# EAGLE design gk+midi board v2.5 (EAGLE 6.3)

## Sheet 1 of 4
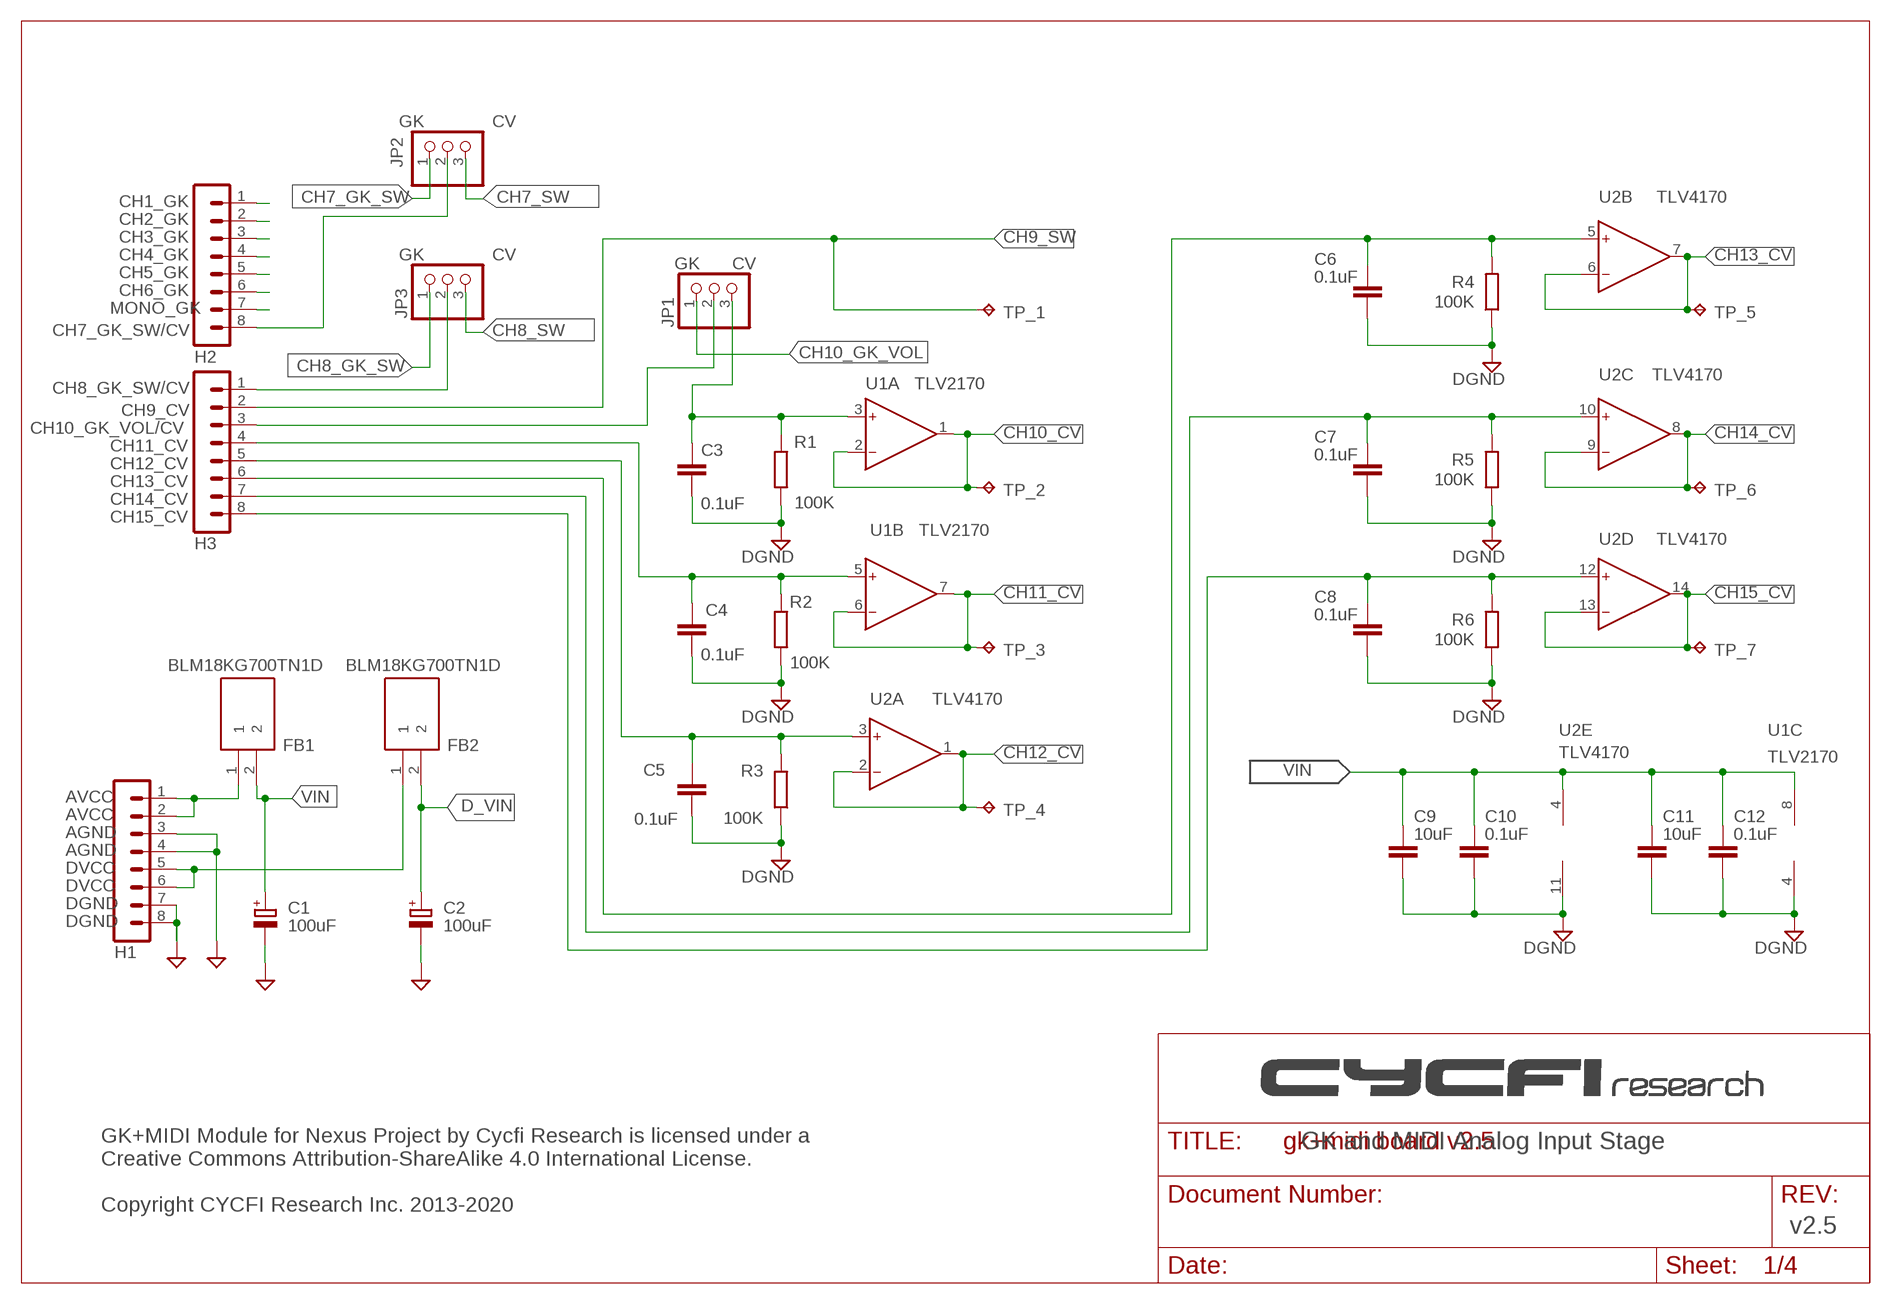
[diagram p0: schematic, sheet 1]

### Parts
C1  100uF  CPOL-EU153CLV-0505  [153CLV-0505]
C2  100uF  CPOL-EU153CLV-0505  [153CLV-0505]
C3  0.1uF  C-EUC0603  [C0603]
C4  0.1uF  C-EUC0603  [C0603]
C5  0.1uF  C-EUC0603  [C0603]
C6  0.1uF  C-EUC0603  [C0603]
C7  0.1uF  C-EUC0603  [C0603]
C8  0.1uF  C-EUC0603  [C0603]
C9  10uF  C-EUC0805  [C0805]
C10  0.1uF  C-EUC0603  [C0603]
C11  10uF  C-EUC0805  [C0805]
C12  0.1uF  C-EUC0603  [C0603]
FB1  BLM18KG700TN1D  [BEADC1608X75N]
FB2  BLM18KG700TN1D  [BEADC1608X75N]
H1  MA08-1  [MA08-1]
H2  MA08-1  [MA08-1]
H3  MA08-1  [MA08-1]
JP1  PINHD-1X03_2.00  [1X03M]
JP2  PINHD-1X03_2.00  [1X03M]
JP3  PINHD-1X03_2.00  [1X03M]
R1  100K  R-EU_R0402  [R0402]
R2  100K  R-EU_R0402  [R0402]
R3  100K  R-EU_R0402  [R0402]
R4  100K  R-EU_R0402  [R0402]
R5  100K  R-EU_R0402  [R0402]
R6  100K  R-EU_R0402  [R0402]
TP_1  TPB1,27  [B1,27]
TP_2  TPB1,27  [B1,27]
TP_3  TPB1,27  [B1,27]
TP_4  TPB1,27  [B1,27]
TP_5  TPB1,27  [B1,27]
TP_6  TPB1,27  [B1,27]
TP_7  TPB1,27  [B1,27]
U1  TLV2170DGKT  [MSOP8]
U2  LMV324  [SSOP-14]

### Nets
AVCC: FB1.1 H1.1 H1.2
CH1_GK: H2.1 ; also sheet 2
CH2_GK: H2.2 ; also sheet 2
CH3_GK: H2.3 ; also sheet 2
CH4_GK: H2.4 ; also sheet 2
CH5_GK: H2.5 ; also sheet 2
CH6_GK: H2.6 ; also sheet 2
CH7_GK_SW: JP2.1 ; also sheet 2
CH7_GK_SW/CV: H2.8 JP2.2
CH7_SW: JP2.3 ; also sheet 3,4
CH8_GK_SW: JP3.1 ; also sheet 2
CH8_GK_SW/CV: H3.1 JP3.2
CH8_SW: JP3.3 ; also sheet 3,4
CH9_SW: H3.2 TP_1.TP ; also sheet 3,4
CH10_CV: TP_2.TP U1.1(OUT) U1.2(IN-) ; also sheet 3
CH10_GK_VOL: JP1.1 ; also sheet 2
CH11_CV: TP_3.TP U1.6(IN-) U1.7(OUT) ; also sheet 3
CH12_CV: TP_4.TP U2.1(OUT) U2.2(IN-) ; also sheet 3
CH13_CV: TP_5.TP U2.6(IN-) U2.7(OUT) ; also sheet 3
CH14_CV: TP_6.TP U2.8(OUT) U2.9(IN-) ; also sheet 3
CH15_CV: TP_7.TP U2.13(IN-) U2.14(OUT) ; also sheet 3
CH15_CV_IN: C8.1 H3.8 R6.2 U2.12(IN+)
D_VIN: C2.+ FB2.2 ; also sheet 4
DVCC: FB2.1 H1.5 H1.6
GND: C1.- C2.- C3.2 C4.2 C5.2 C6.2 C7.2 C8.2 C9.2 C10.2 C11.2 C12.2 H1.3 H1.4 H1.7 H1.8 R1.1 R2.1 R3.1 R4.1 R5.1 R6.1 U1.4(V-) U2.11(P1:V-) ; supply symbol labelled DGND ; also sheet 2,3,4
MONO_GK: H2.7 ; also sheet 2
N$4: H3.3 JP1.2
N$10: C3.1 JP1.3 R1.2 U1.3(IN+)
N$11: C4.1 H3.4 R2.2 U1.5(IN+)
N$14: C5.1 H3.5 R3.2 U2.3(IN+)
N$19: C6.1 H3.6 R4.2 U2.5(IN+)
N$20: C7.1 H3.7 R5.2 U2.10(IN+)
VIN: C1.+ C9.1 C10.1 C11.1 C12.1 FB1.2 U1.8(V+) U2.4(P1:V+)

### Notes on the sheet
- GK | CV
- CH1_GK | U2B | TLV4170
- CH2_GK
- CH3_GK
- CH4_GK | GK | CV
- GK | CV
- CH5_GK
- CH6_GK
- MONO_GK
- CH7_GK_SW/CV
- U2C | TLV4170
- CH8_GK_SW/CV | U1A | TLV2170
- CH9_CV
- CH10_GK_VOL/CV
- CH11_CV
- CH12_CV
- CH13_CV
- CH14_CV
- CH15_CV
- U1B | TLV2170
- U2D | TLV4170
- U2A | TLV4170
- U2E | U1C
- TLV4170 | TLV2170
- AGND
- AGND
- DGND
- DGND
- GK and MIDI Analog Input Stage
- GK+MIDI Module for Nexus Project by Cycfi Research is licensed under a 
  Creative Commons Attribution-ShareAlike 4.0 International License.
  
  Copyright CYCFI Research Inc. 2013-2020
- v2.5

## Sheet 2 of 4
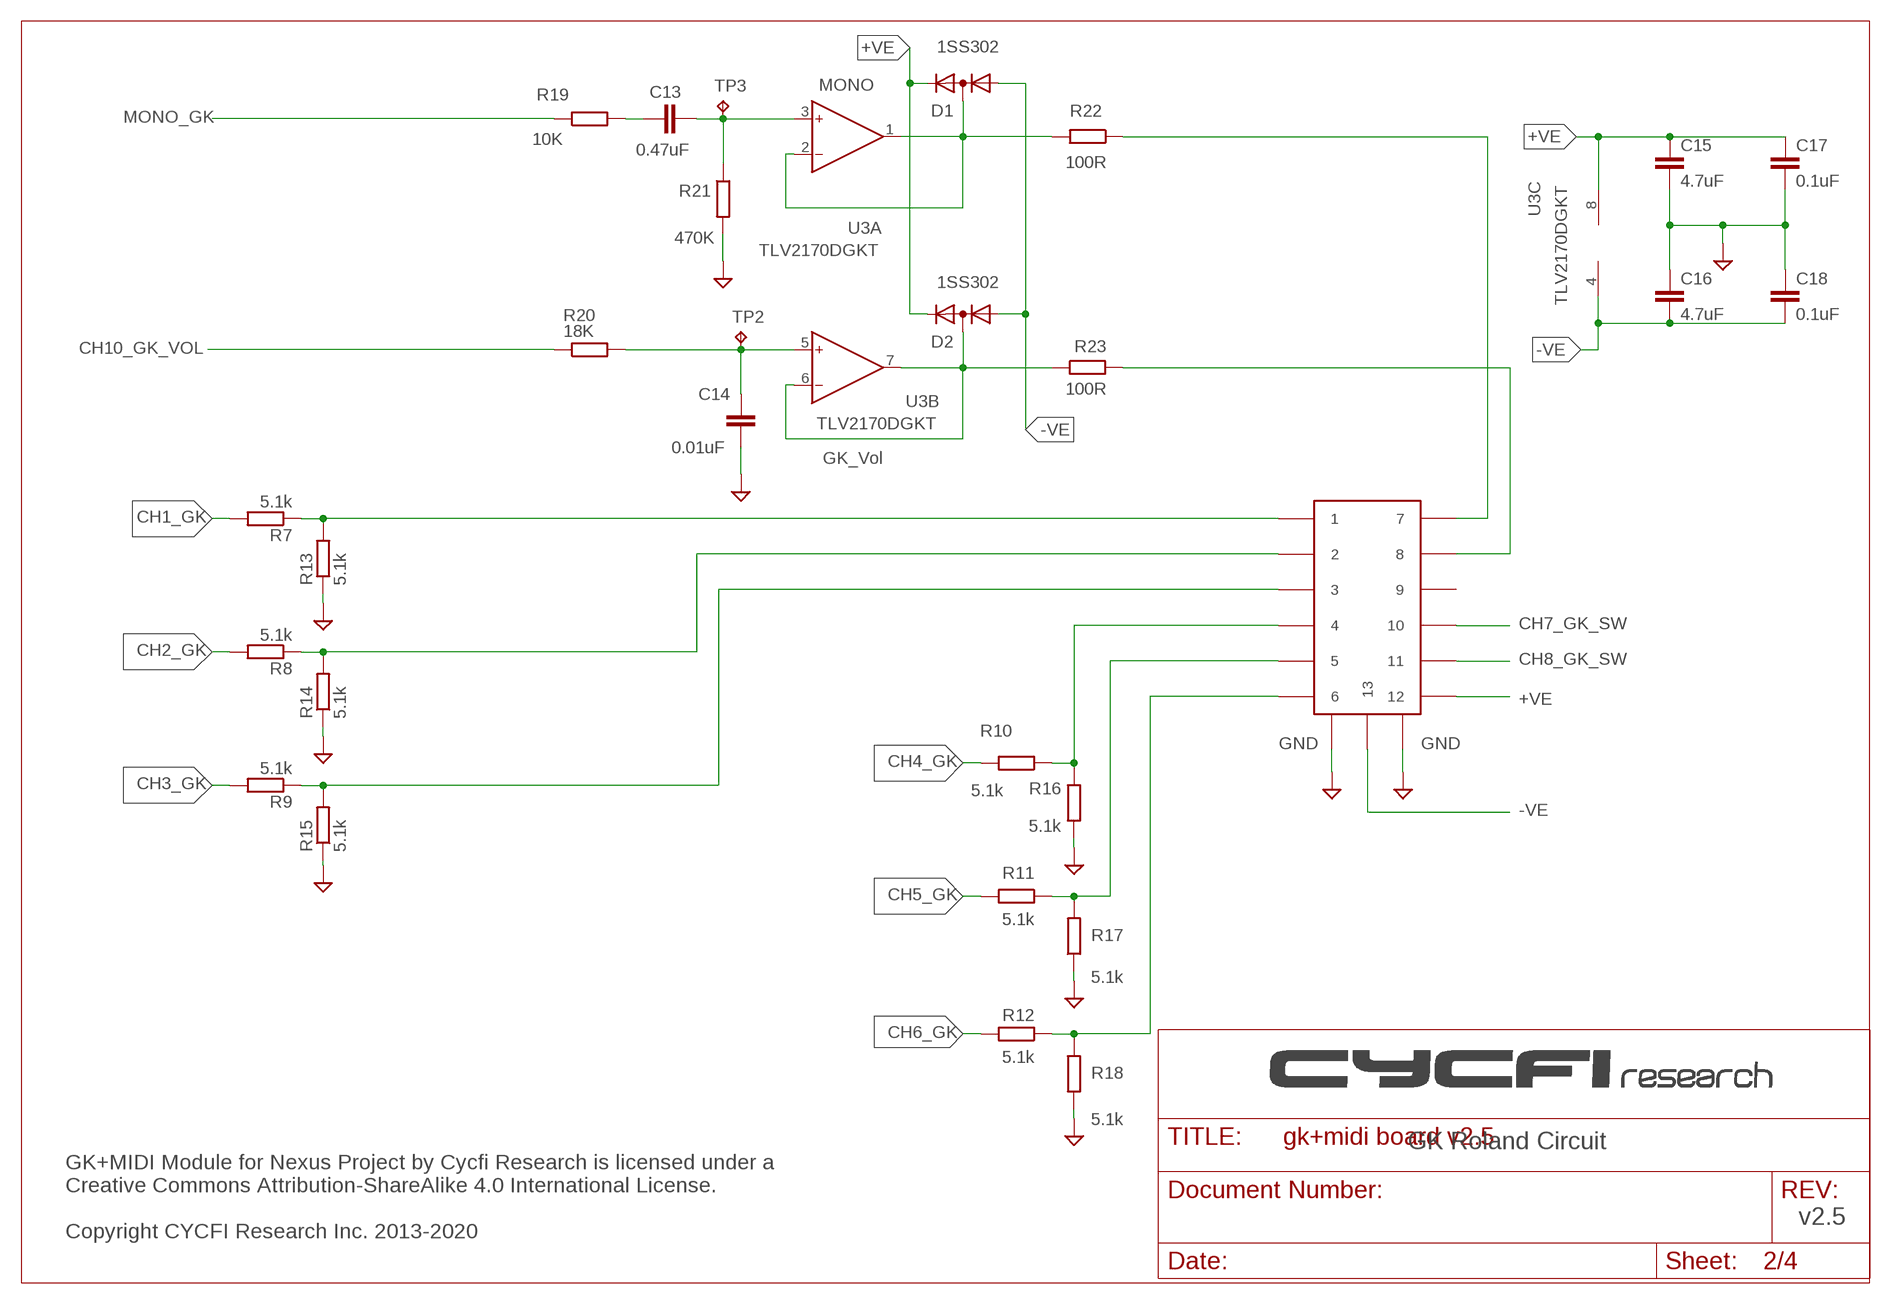
[diagram p1: schematic, sheet 2]

### Parts
C13  0.47uF  C-EUC0603  [C0603]
C14  0.01uF  C-EUC0402  [C0402]
C15  4.7uF  C-EUC0603  [C0603]
C16  4.7uF  C-EUC0603  [C0603]
C17  0.1uF  C-EUC0402  [C0402]
C18  0.1uF  C-EUC0402  [C0402]
D1  1SS302  [SC70-3]
D2  1SS302  [SC70-3]
R7  5.1k  R-EU_R0402  [R0402]
R8  5.1k  R-EU_R0402  [R0402]
R9  5.1k  R-EU_R0402  [R0402]
R10  5.1k  R-EU_R0402  [R0402]
R11  5.1k  R-EU_R0402  [R0402]
R12  5.1k  R-EU_R0402  [R0402]
R13  5.1k  R-EU_R0402  [R0402]
R14  5.1k  R-EU_R0402  [R0402]
R15  5.1k  R-EU_R0402  [R0402]
R16  5.1k  R-EU_R0402  [R0402]
R17  5.1k  R-EU_R0402  [R0402]
R18  5.1k  R-EU_R0402  [R0402]
R19  10K  R-EU_R0402  [R0402]
R20  18K  R-EU_R0402  [R0402]
R21  470K  R-EU_R0402  [R0402]
R22  100R  R-EU_R0402  [R0402]
R23  100R  R-EU_R0402  [R0402]
TP2  TPB1,27  [B1,27]
TP3  TPB1,27  [B1,27]
U3  TLV2170DGKT  [MSOP8]
U$1  13P_MIDI_2  [13P-MIDI-2]

### Nets
+VE: C15.1 C17.1 D1.2(K) D2.2(K) U3.8(V+) U$1.12
-VE: C16.2 C18.2 D1.1(A) D2.1(A) U3.4(V-) U$1.13
CH1_GK: R7.2 ; also sheet 1
CH2_GK: R8.2 ; also sheet 1
CH3_GK: R9.2 ; also sheet 1
CH4_GK: R10.2 ; also sheet 1
CH5_GK: R11.2 ; also sheet 1
CH6_GK: R12.2 ; also sheet 1
CH7_GK_SW: U$1.10 ; also sheet 1
CH8_GK_SW: U$1.11 ; also sheet 1
CH10_GK_VOL: R20.1 ; also sheet 1
GK_VOL: R23.2 U$1.8
GND: C14.2 C15.2 C16.1 C17.2 C18.1 R13.1 R14.1 R15.1 R16.1 R17.1 R18.1 R21.2 U$1.P$1 U$1.P$2 ; also sheet 1,3,4
MONO_GK: R19.1 ; also sheet 1
N$21: R22.1 U$1.7
N$35: D2.3(AK) R23.1 U3.6(IN-) U3.7(OUT)
N$36: C14.1 R20.2 TP2.TP U3.5(IN+)
N$37: C13.2 R19.2
N$38: C13.1 R21.1 TP3.TP U3.3(IN+)
N$39: D1.3(AK) R22.2 U3.1(OUT) U3.2(IN-)
N$42: R7.1 R13.2 U$1.1
N$43: R8.1 R14.2 U$1.2
N$44: R9.1 R15.2 U$1.3
N$45: R10.1 R16.2 U$1.4
N$46: R11.1 R17.2 U$1.5
N$47: R12.1 R18.2 U$1.6
Unconnected: U$1.9

### Notes on the sheet
- MONO
- U3C
- U3A
- U3B
- GK_Vol
- GK Roland Circuit
- v2.5
- GK+MIDI Module for Nexus Project by Cycfi Research is licensed under a 
  Creative Commons Attribution-ShareAlike 4.0 International License.
  
  Copyright CYCFI Research Inc. 2013-2020

## Sheet 3 of 4
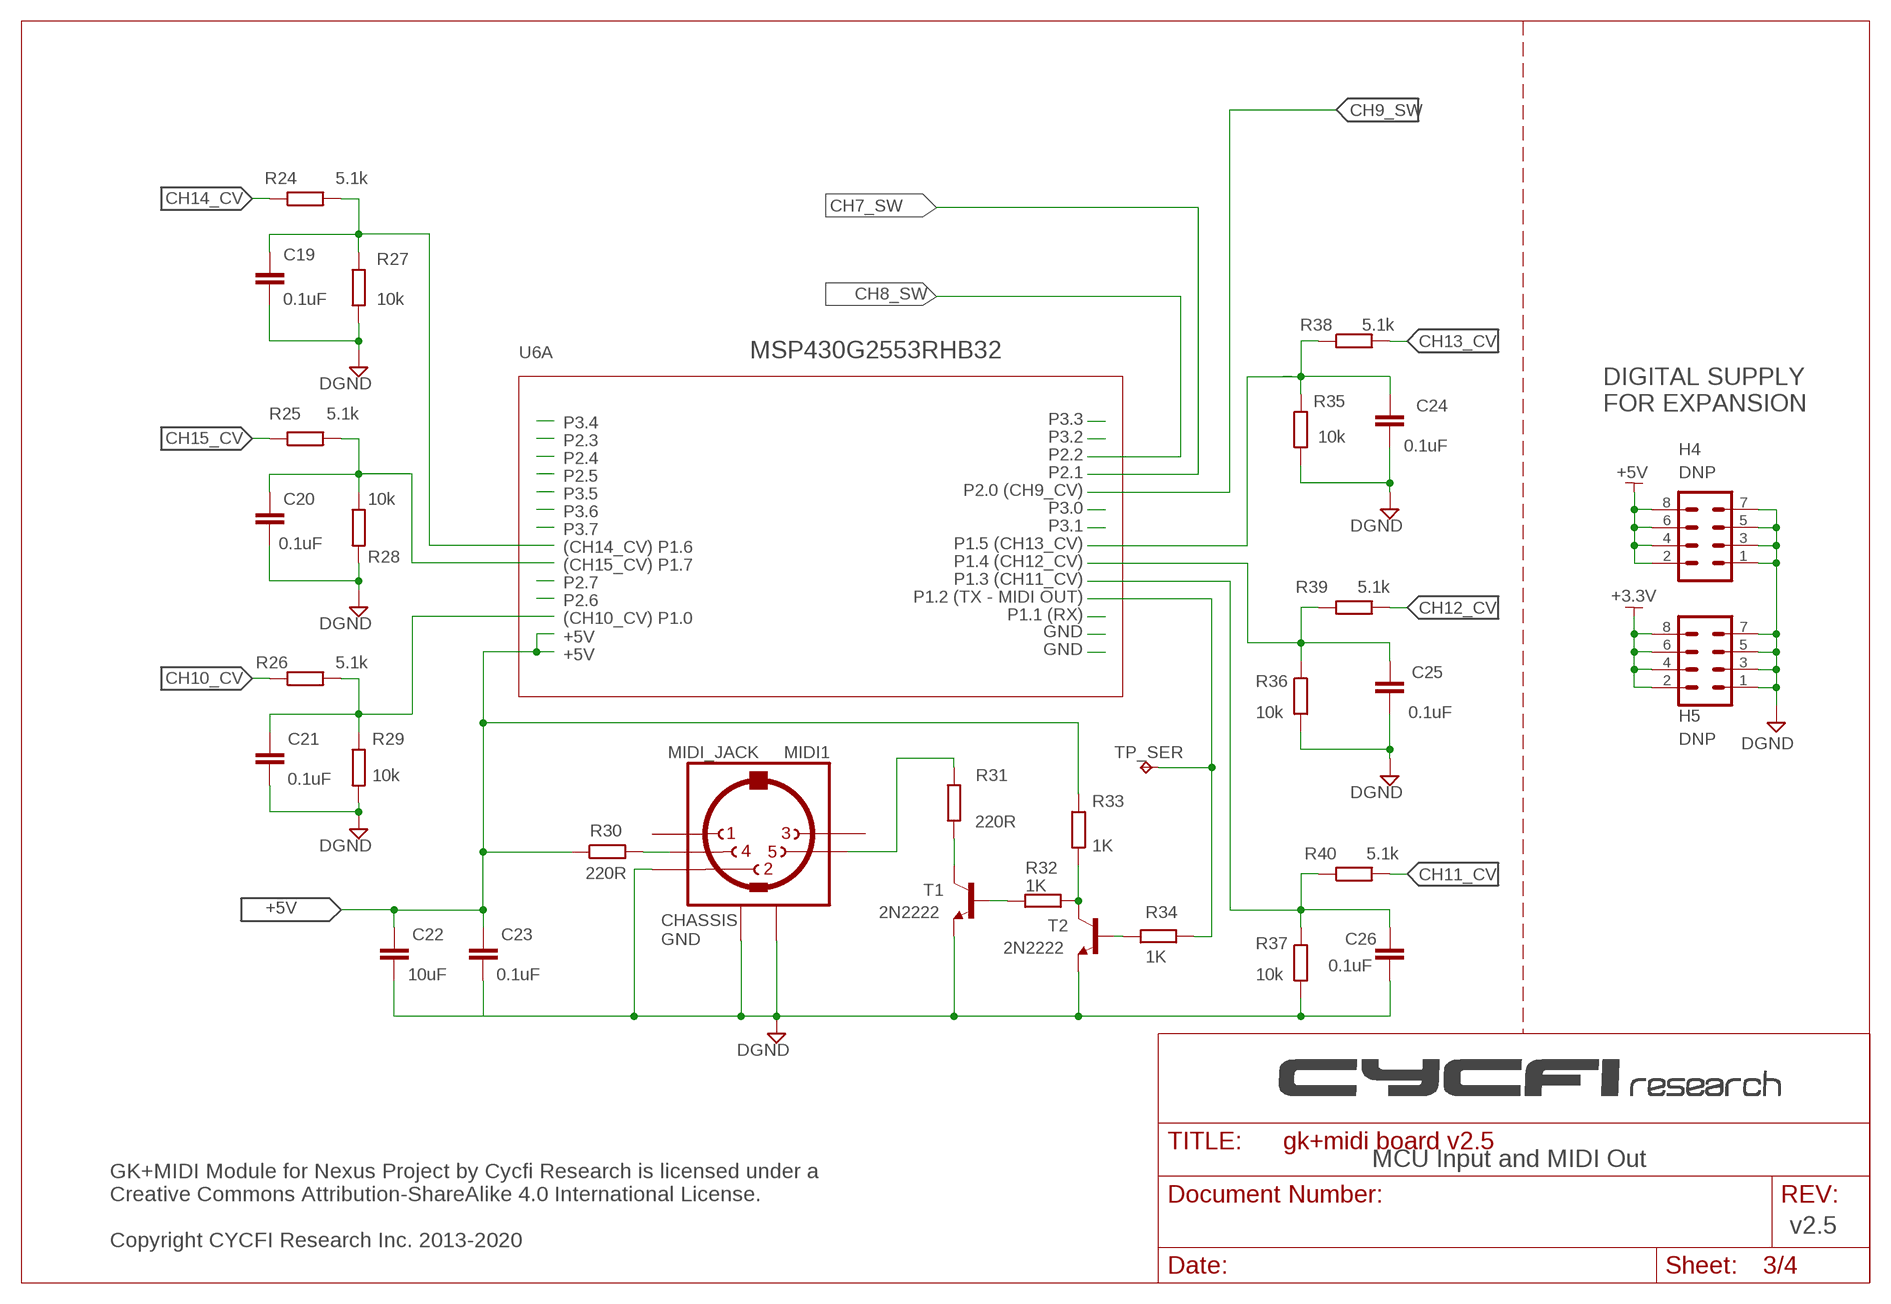
[diagram p2: schematic, sheet 3]

### Parts
C19  0.1uF  C-EUC0603  [C0603]
C20  0.1uF  C-EUC0603  [C0603]
C21  0.1uF  C-EUC0603  [C0603]
C22  10uF  C-EUC0805  [C0805]
C23  0.1uF  C-EUC0603  [C0603]
C24  0.1uF  C-EUC0603  [C0603]
C25  0.1uF  C-EUC0603  [C0603]
C26  0.1uF  C-EUC0603  [C0603]
H4  DNP  MA04-2  [MA04-2]
H5  DNP  MA04-2  [MA04-2]
MIDI1  MIDI_JACK  [MIDI_JACK]
R24  5.1k  R-EU_R0402  [R0402]
R25  5.1k  R-EU_R0402  [R0402]
R26  5.1k  R-EU_R0402  [R0402]
R27  10k  R-EU_R0402  [R0402]
R28  10k  R-EU_R0402  [R0402]
R29  10k  R-EU_R0402  [R0402]
R30  220R  R-EU_R0603  [R0603]
R31  220R  R-EU_R0603  [R0603]
R32  1K  R-EU_R0402  [R0402]
R33  1K  R-EU_R0402  [R0402]
R34  1K  R-EU_R0402  [R0402]
R35  10k  R-EU_R0402  [R0402]
R36  10k  R-EU_R0402  [R0402]
R37  10k  R-EU_R0402  [R0402]
R38  5.1k  R-EU_R0402  [R0402]
R39  5.1k  R-EU_R0402  [R0402]
R40  5.1k  R-EU_R0402  [R0402]
T1  2N2222  TRAN-MMBT2222A  [SOT23-3]
T2  2N2222  TRAN-MMBT2222A  [SOT23-3]
TP_SER  TPB1,27  [B1,27]

### Nets
+3.3V: H5.2 H5.4 H5.6 H5.8 ; also sheet 4
+5V: C22.1 C23.1 H4.2 H4.4 H4.6 H4.8 R30.1 R33.2 ; also sheet 4
CH10_CV: R26.1 ; also sheet 1
CH11_CV: R40.2 ; also sheet 1
CH12_CV: R39.2 ; also sheet 1
CH13_CV: R38.2 ; also sheet 1
CH14_CV: R24.1 ; also sheet 1
CH15_CV: R25.1 ; also sheet 1
GND: C19.2 C20.2 C21.2 C22.2 C23.2 C24.2 C25.2 C26.2 H4.1 H4.3 H4.5 H4.7 H5.1 H5.3 H5.5 H5.7 MIDI1.2 MIDI1.G1 MIDI1.G2 R27.2 R28.2 R29.2 R35.2 R36.2 R37.2 T1.2(E) T2.2(E) ; supply symbol labelled DGND ; also sheet 1,2,4
N$1: MIDI1.5 R31.2
N$2: R31.1 T1.3(C)
N$3: R32.2 T1.1(B)
N$5: MIDI1.4 R30.2
N$8: R34.2 T2.1(B)
N$9: R32.1 R33.1 T2.3(C)
P1.0: C21.1 R26.2 R29.1 ; also sheet 4
P1.2: R34.1 TP_SER.TP ; also sheet 4
P1.3: C26.1 R37.1 R40.1 ; also sheet 4
P1.4: C25.1 R36.1 R39.1 ; also sheet 4
P1.5: C24.1 R35.1 R38.1 ; also sheet 4
P1.6: C19.1 R24.2 R27.1 ; also sheet 4
P1.7: C20.1 R25.2 R28.1 ; also sheet 4
Unconnected: MIDI1.1 MIDI1.3

### Notes on the sheet
- U6A | MSP430G2553RHB32
- DIGITAL SUPPLY
  FOR EXPANSION
- P3.4
- P3.3
- P2.3
- P3.2
- P2.4
- P2.2
- P2.5
- P2.1
- P3.5
- P2.0 (CH9_CV)
- P3.6
- P3.0
- P3.7
- P3.1
- (CH14_CV) P1.6
- P1.5 (CH13_CV)
- (CH15_CV) P1.7
- P1.4 (CH12_CV)
- P2.7
- P1.3 (CH11_CV)
- P2.6
- P1.2 (TX - MIDI OUT)
- (CH10_CV) P1.0
- P1.1 (RX)
- CHASSIS 
  GND
- MCU Input and MIDI Out
- v2.5
- GK+MIDI Module for Nexus Project by Cycfi Research is licensed under a
  Creative Commons Attribution-ShareAlike 4.0 International License.
  
  Copyright CYCFI Research Inc. 2013-2020

## Sheet 4 of 4
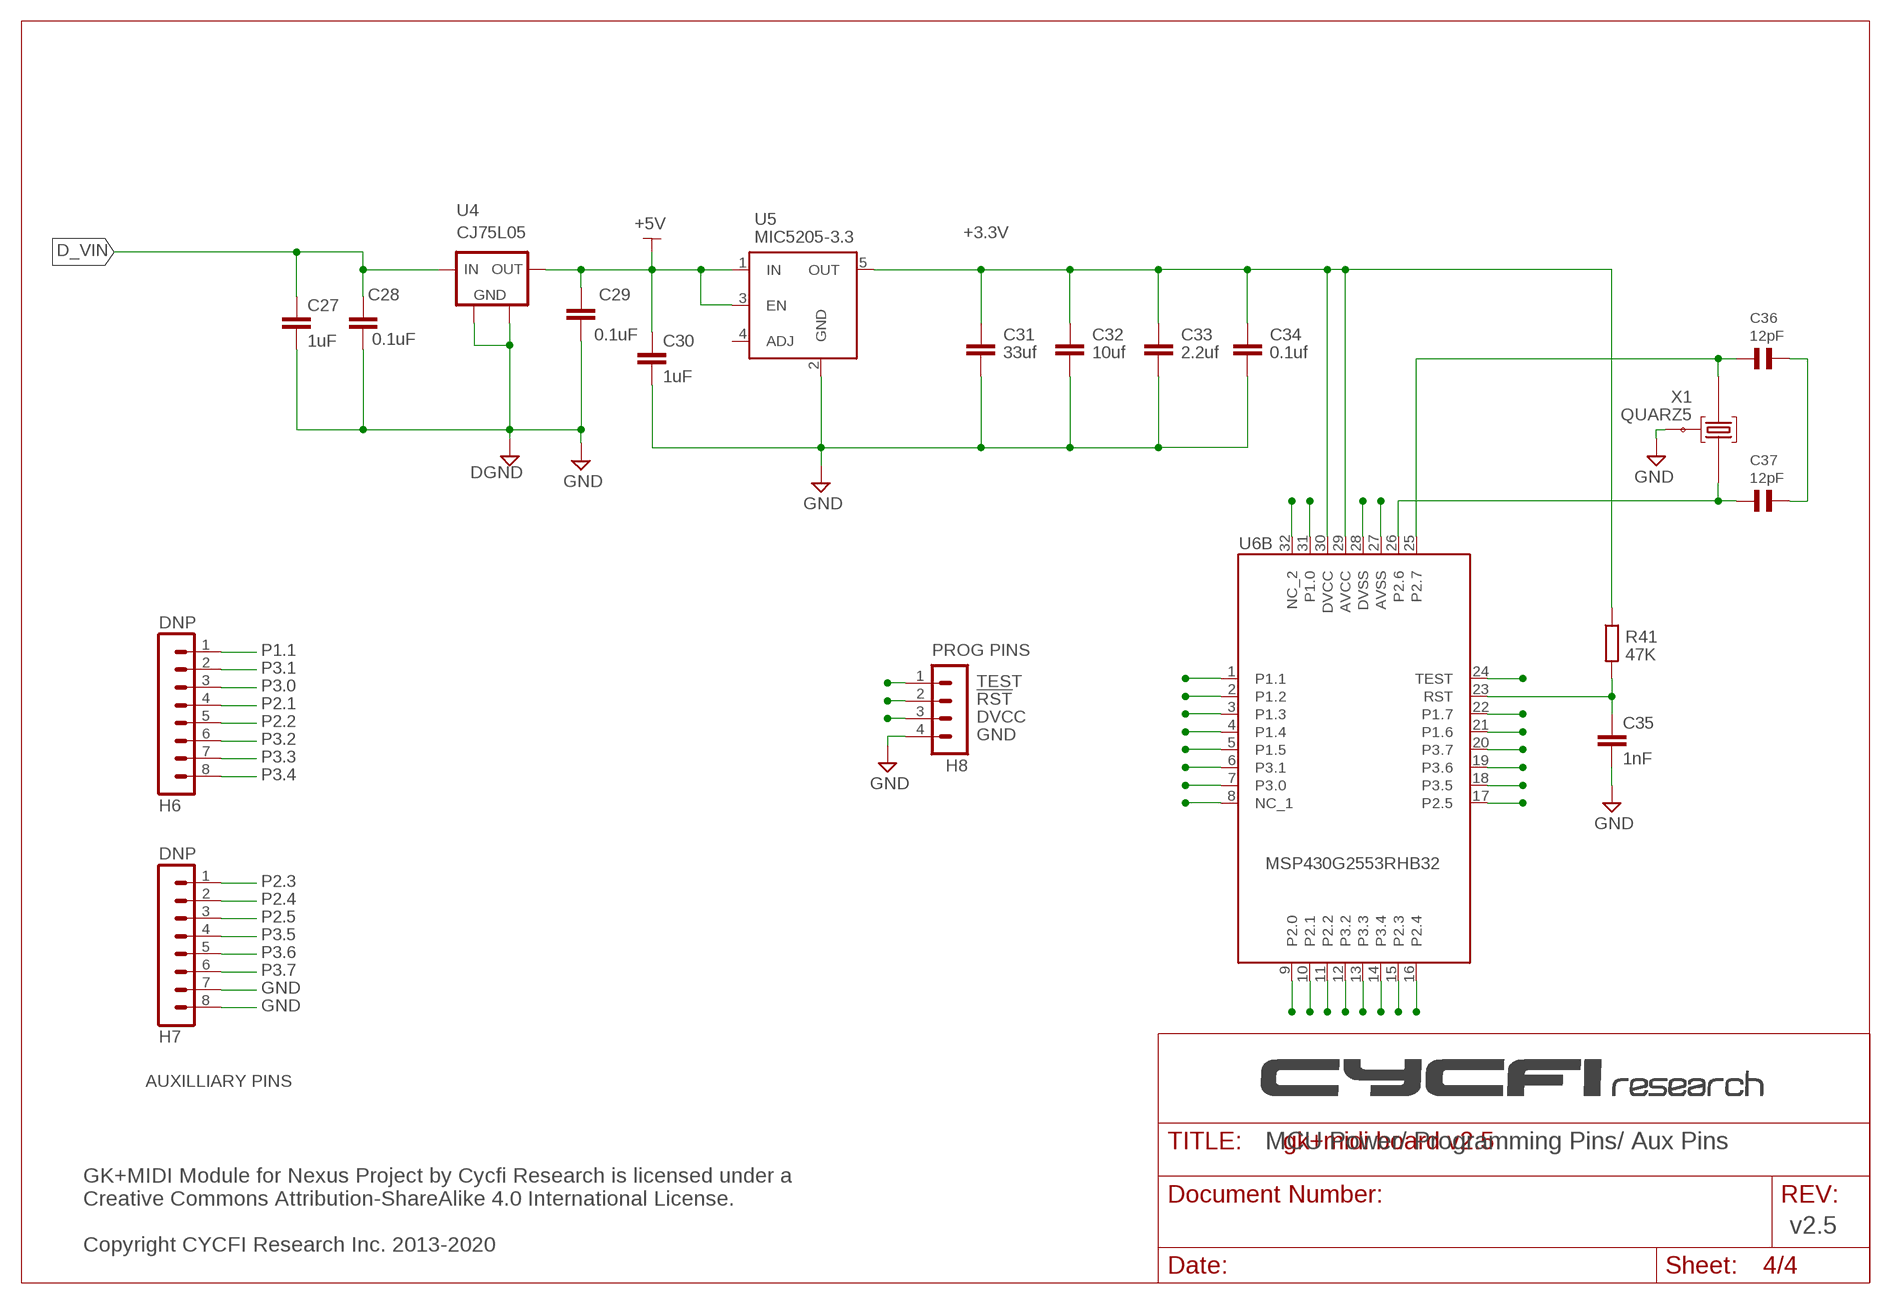
[diagram p3: schematic, sheet 4]

### Parts
C27  1uF  C-EUC0402  [C0402]
C28  0.1uF  C-EUC0603  [C0603]
C29  0.1uF  C-EUC0603  [C0603]
C30  1uF  C-EUC0402  [C0402]
C31  33uf  C-EUC0805  [C0805]
C32  10uf  C-EUC0805  [C0805]
C33  2.2uf  C-EUC0805  [C0805]
C34  0.1uf  C-EUC0603  [C0603]
C35  1nF  C-EUC0402  [C0402]
C36  12pF  C_SMD0603  [0603]
C37  12pF  C_SMD0603  [0603]
H6  DNP  MA08-1  [MA08-1]
H7  DNP  MA08-1  [MA08-1]
H8  MA04-1  [MA04-1]
R41  47K  R-EU_R0402  [R0402]
U4  L78LXX  [SOT89]
U5  MIC5205-3.3  MIC5219BM5  [SOT23-5]
U6B  MSP430G2553RHB32  [QFN32]
X1  QUARZ5  [QUARZ5]

### Nets
!RST: C35.1 H8.2 R41.2 U6B.23(RST)
+3.3V: C31.1 C32.1 C33.1 C34.1 H8.3 R41.1 U5.5(OUT) U6B.29(AVCC) U6B.30(DVCC) ; also sheet 3
+5V: C29.1 C30.1 U4.1(IN) U5.1(IN) U5.3(EN) ; also sheet 3
CH7_SW: H6.4 U6B.10(P2.1) ; also sheet 1,3
CH8_SW: H6.5 U6B.11(P2.2) ; also sheet 1,3
CH9_SW: U6B.9(P2.0) ; also sheet 1,3
D_VIN: C27.1 C28.1 U4.3(OUT) ; also sheet 1
GND: C27.2 C28.2 C29.2 C30.2 C31.2 C32.2 C33.2 C34.2 C35.2 C36.1 C37.1 H7.7 H7.8 H8.4 U4.2(GND) U4.2@1(GND1) U5.2(GND) U6B.27(AVSS) U6B.28(DVSS) X1.GND@0 ; supply symbol labelled DGND ; also sheet 1,2,3
N$6: U6B.32(NC_2)
NC: U6B.8(NC_1)
P1.0: U6B.31(P1.0) ; also sheet 3
P1.1: H6.1 U6B.1(P1.1) ; also sheet 3
P1.2: U6B.2(P1.2) ; also sheet 3
P1.3: U6B.3(P1.3) ; also sheet 3
P1.4: U6B.4(P1.4) ; also sheet 3
P1.5: U6B.5(P1.5) ; also sheet 3
P1.6: U6B.21(P1.6) ; also sheet 3
P1.7: U6B.22(P1.7) ; also sheet 3
P2.3: H7.1 U6B.15(P2.3) ; also sheet 3
P2.4: H7.2 U6B.16(P2.4) ; also sheet 3
P2.5: H7.3 U6B.17(P2.5) ; also sheet 3
P2.6: C37.2 U6B.26(P2.6) X1.1 ; also sheet 3
P2.7: C36.2 U6B.25(P2.7) X1.2 ; also sheet 3
P3.0: H6.3 U6B.7(P3.0) ; also sheet 3
P3.1: H6.2 U6B.6(P3.1) ; also sheet 3
P3.2: H6.6 U6B.12(P3.2) ; also sheet 3
P3.3: H6.7 U6B.13(P3.3) ; also sheet 3
P3.4: H6.8 U6B.14(P3.4) ; also sheet 3
P3.5: H7.4 U6B.18(P3.5) ; also sheet 3
P3.6: H7.5 U6B.19(P3.6) ; also sheet 3
P3.7: H7.6 U6B.20(P3.7) ; also sheet 3
TEST: H8.1 U6B.24(TEST)
Unconnected: U5.4(ADJ)

### Notes on the sheet
- CJ75L05
- PROG PINS
- TEST
- P2.1 | !RST
- P2.2 | DVCC
- GND
- AUXILLIARY PINS
- MCU Power/ Programming Pins/ Aux Pins
- v2.5
- GK+MIDI Module for Nexus Project by Cycfi Research is licensed under a 
  Creative Commons Attribution-ShareAlike 4.0 International License.
  
  Copyright CYCFI Research Inc. 2013-2020

## Library data of the parts
C1 C2 = resistor:CPOL-EU: POLARIZED CAPACITOR, European symbol
C3-C35 = resistor:C-EU: CAPACITOR, European symbol
C36 C37 = ssmd:C_SMD
D1 D2 = CYCFI_semicon:1SS302
FB1 FB2 = SamacSys_Parts:BLM18KG700TN1D: BLM18_N1D Series EMI Suppression Filter 70+/-25% at 100MHz 3.5A @85 Source: Datasheet <https://componentsearchengine.com/Datasheets/1/BLM18KG700TN1D.pdf>; DESCRIPTION: BLM18_N1D Series EMI Suppression Filter 70+/-25% at 100MHz 3.5A @85; HEIGHT: 0.75mm; MANUFACTURER_NAME: Murata Electronics; MANUFACTURER_PART_NUMBER: BLM18KG700TN1D; MOUSER_PART_NUMBER: 81-BLM18KG700TN1D; MOUSER_PRICE-STOCK: https://www.mouser.com/Search/Refine.aspx?Keyword=81-BLM18KG700TN1D
H1-H3 H6 H7 = con-lstb:MA08-1: PIN HEADER; OC_FARNELL: unknown; OC_NEWARK: unknown
H4 H5 = con-lstb:MA04-2: PIN HEADER; OC_FARNELL: unknown; OC_NEWARK: unknown
H8 = con-lstb:MA04-1: PIN HEADER; OC_FARNELL: unknown; OC_NEWARK: unknown
JP1-JP3 = pinhead-2:PINHD-1X03: PIN HEADER
MIDI1 = CYCFI_Con:MIDI_JACK
R1-R41 = resistor:R-EU_: RESISTOR, European symbol
T1 T2 = Cycfi:TRAN-MMBT2222A
TP2 TP3 TP_1-TP_7 TP_SER = testpad:TP: Test pad
U1 U3 = CYCFI_semicon:TLV2170DGKT
U2 = CYCFI_semicon:LMV324
U4 = CYCFI_Power:L78LXX
U5 = v-reg-micrel:MIC5219BM5: VOLTAGE REGULATOR; MF: ALTERA CORPORATION; MPN: MIC5219BM5 TR; OC_FARNELL: 1100656; OC_NEWARK: 09J8939
U6B = CYCFI_IC:MSP430G2553RHB32
U$1 = CYCFI_Con:13P_MIDI_2
X1 = sMSP430:QUARZ5

## Board
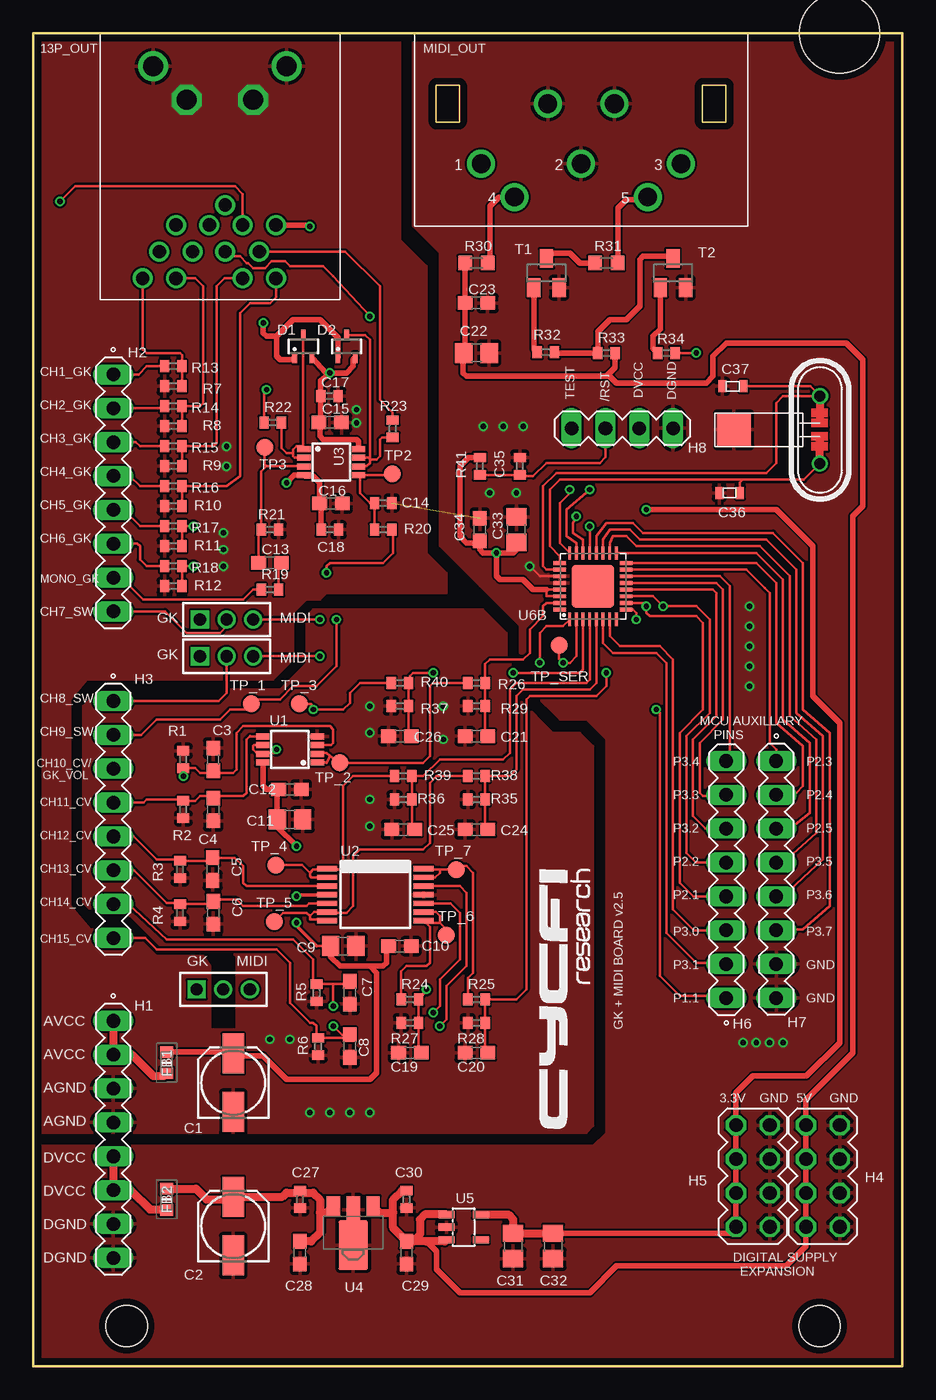
[diagram p4: board, top side]
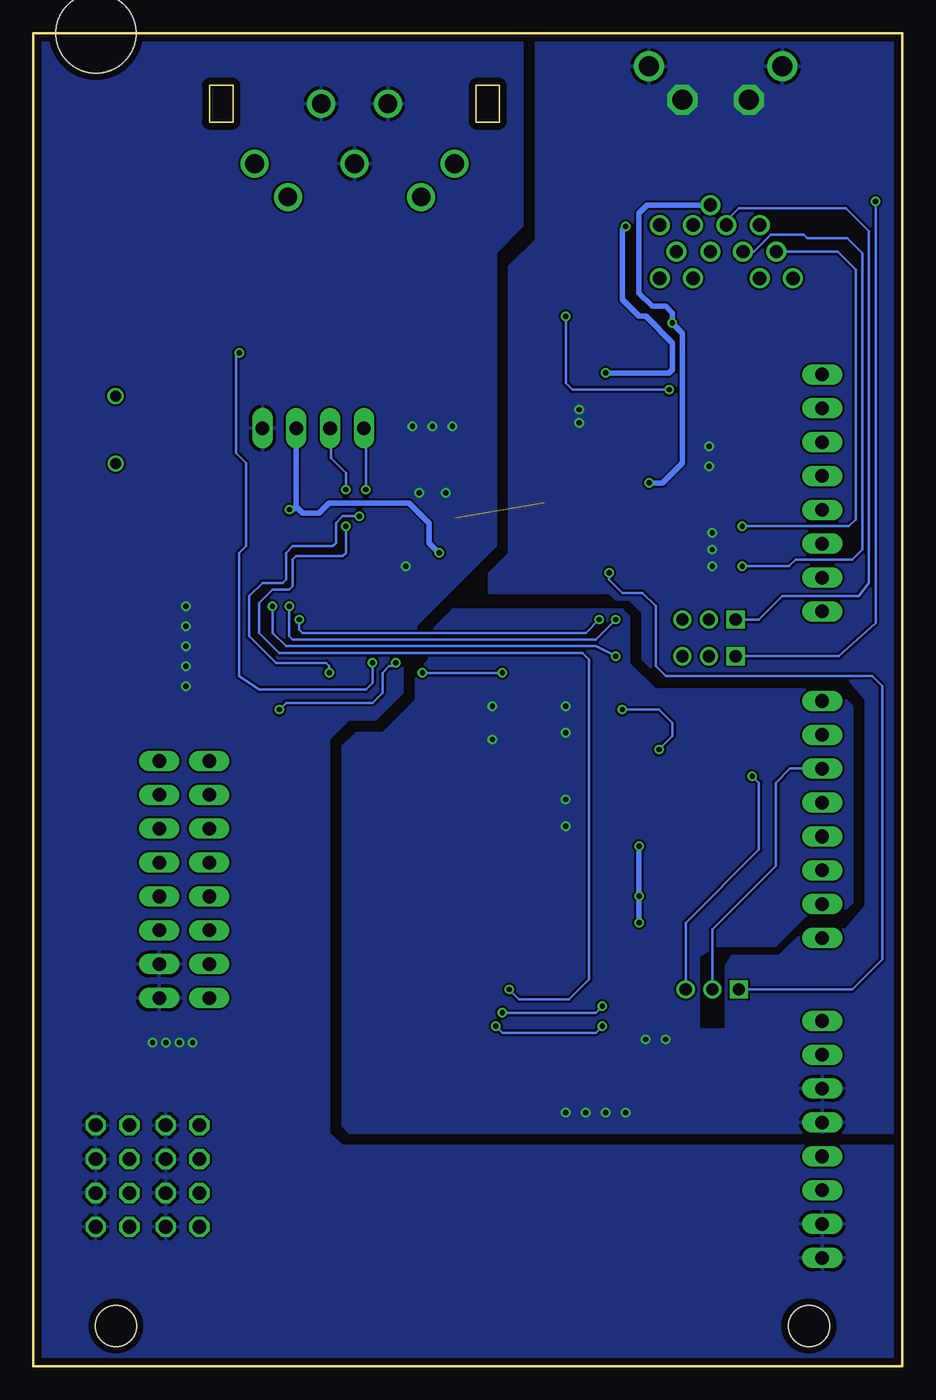
[diagram p5: board, bottom side, seen from below]

Size 65.2 x 100 mm. Coordinates in mm from the lower left corner, seen from the top.
Outline: 0,0 65.2,0 65.2,100 0,100 0,0
Copper layers (1*16): Top 0.035mm / dielectric 1.6mm / Bottom 0.035mm
Design rules "Elecrow_2-layer_PCB_eagle_rule": minimum track width 6mil, minimum drill 12mil, track to track 6mil, track to pad 8mil, pad to pad 12mil, via to via 12mil, smd to smd 0mil, copper to edge 20mil, drill to drill 10mil, minimum pad ring 6mil, minimum via ring 6mil, stop-mask expansion 0mil, vias tented up to drill 100mil, thermal gap 10mil
Holes 3.1 mm at 59,3.02 7,3.02
Holes 6 mm at 60.5,100.02

### Footprints (pad centres in the part's own frame; a part is rotated, then mirrored left to right if it is on the bottom)
153CLV-0505 = smd 3 x 1.6: + 2.2,0; - -2.2,0
C0603 = smd 1.1 x 1: 1 -0.85,0; 2 0.85,0
C0805 = smd 1.3 x 1.5: 1 -0.95,0; 2 0.95,0
C0402 = smd 0.7 x 0.9: 1 -0.65,0; 2 0.65,0
0603 = smd 0.6 x 0.9: 1 -0.787,0; 2 0.787,0
SC70-3 = smd 0.35 x 0.8: 1 -0.65,-0.85; 2 0.65,-0.85; 3 0,0.85
BEADC1608X75N = smd 0.85 x 1: 1 -0.8,0; 2 0.8,0
MA08-1 = drill 1.016 long: 1 -8.89,0; 2 -6.35,0; 3 -3.81,0; 4 -1.27,0; 5 1.27,0; 6 3.81,0; 7 6.35,0; 8 8.89,0
MA04-2 = drill 1.016 octagon: 1 -3.81,-1.27; 2 -3.81,1.27; 3 -1.27,-1.27; 4 -1.27,1.27; 5 1.27,-1.27; 6 1.27,1.27; 7 3.81,-1.27; 8 3.81,1.27
MA04-1 = drill 1.016 long: 1 -3.81,0; 2 -1.27,0; 3 1.27,0; 4 3.81,0
1X03M = drill 0.914 square: 1 -2,0 | drill 0.914: 2 0,0; 3 2,0
MIDI_JACK = drill 1.4: 1 -7.5,0; 2 0,0; 3 7.5,0; 4 -5,-2.5; 5 5,-2.5; G1 -2.5,4.5; G2 2.5,4.5
R0402 = smd 0.7 x 0.9: 1 -0.65,0; 2 0.65,0
R0603 = smd 1 x 1.1: 1 -0.85,0; 2 0.85,0
SOT23-3 = smd 1 x 1.4: 1 -0.95,-1.1; 2 0.95,-1.1; 3 0,1.1
B1,27 = smd 1.27 x 1.27: TP 0,0
MSOP8 = smd 0.45 x 1: 1 -0.975,-2.05; 2 -0.325,-2.05; 3 0.325,-2.05; 4 0.975,-2.05; 5 0.975,2.05; 6 0.325,2.05; 7 -0.325,2.05; 8 -0.975,2.05
SSOP-14 = smd 0.4 x 1.5: 1 -1.95,-3.625; 2 -1.3,-3.625; 3 -0.65,-3.625; 4 0,-3.625; 5 0.65,-3.625; 6 1.3,-3.625; 7 1.95,-3.625; 8 1.95,3.625; 9 1.3,3.625; 10 0.65,3.625; 11 0,3.625; 12 -0.65,3.625; 13 -1.3,3.625; 14 -1.95,3.625
SOT89 = smd 1 x 1.5: 1 -1.499,-1.981; 3 1.499,-1.981 | smd 1 x 2: 2 0,-1.727 | smd 2.2 x 3.7: 2@1 0,0.94
SOT23-5 = smd 0.55 x 1.2: 1 -0.95,-1.3; 2 0,-1.3; 3 0.95,-1.3; 4 0.95,1.3; 5 -0.95,1.3
QFN32 = smd 1.016 x 0.3: 1 -2.49,1.75; 2 -2.49,1.25; 3 -2.49,0.75; 4 -2.49,0.25; 5 -2.49,-0.25; 6 -2.49,-0.75; 7 -2.49,-1.25; 8 -2.49,-1.75; 17 2.49,-1.75; 18 2.49,-1.25; 19 2.49,-0.75; 20 2.49,-0.25; 21 2.49,0.25; 22 2.49,0.75; 23 2.49,1.25; 24 2.49,1.75 | smd 0.3 x 1.016: 9 -1.75,-2.49; 10 -1.25,-2.49; 11 -0.75,-2.49; 12 -0.25,-2.49; 13 0.25,-2.49; 14 0.75,-2.49; 15 1.25,-2.49; 16 1.75,-2.49; 25 1.75,2.49; 26 1.25,2.49; 27 0.75,2.49; 28 0.25,2.49; 29 -0.25,2.49; 30 -0.75,2.49; 31 -1.25,2.49; 32 -1.75,2.49 | smd 3.2 x 3.2: EXP 0,0
13P-MIDI-2 = drill 1: 1 -5.8,-15.9; 2 -3.3,-15.9; 3 1.7,-15.9; 4 4.2,-15.9; 5 -4.55,-13.9; 6 -2.05,-13.9; 7 0.4,-13.9; 8 2.95,-13.9; 9 -3.3,-11.9; 10 -0.8,-11.9; 11 1.7,-11.9; 12 4.2,-11.9; 13 0.4,-10.4 | drill 1.5: P$1 5,0; P$2 -5,0
QUARZ5 = drill 0.813: 1 1.53,1.773; 2 1.52,-3.303 | smd 2.54 x 2.54: GND@0 -4.941,-0.762

### Placement (x,y rotation side)
C1  15,21.27 90 top
C2  15,10.52 90 top
C3  13.5,45.52 90 top
C4  13.5,41.77 270 top
C5  13.46,37.3 270 top
C6  13.5,34.02 270 top
C7  23.75,28.02 270 top
C8  23.75,24.02 270 top
C9  23.25,31.52 0 top
C10  27.5,31.52 0 top
C11  19.25,41.02 0 top
C12  19.25,43.27 0 top
C13  17.75,60.27 0 top
C14  26.25,64.77 0 top
C15  22.27,70.81 0 top
C16  22.33,64.73 180 top
C17  22.22,72.8 0 top
C18  22.25,62.77 180 top
C19  28.25,23.52 180 top
C20  33.25,23.52 180 top
C21  33.25,47.27 180 top
C22  33.25,76.02 0 top
C23  33.25,79.77 0 top
C24  33.25,40.27 180 top
C25  27.75,40.27 180 top
C26  27.5,47.27 180 top
C27  20,12.52 270 top
C28  20,8.52 270 top
C29  28,8.52 270 top
C30  28,12.52 270 top
C31  36,9.02 270 top
C32  39,9.02 270 top
C33  36.25,62.77 90 top
C34  33.5,62.77 90 top
C35  36.5,67.52 90 top
C36  52.25,65.52 0 top
C37  52.5,73.52 0 top
D1  20.25,76.52 0 top
D2  23.5,76.52 0 top
FB1  10,22.77 90 top
FB2  10,12.52 90 top
H1  6,17.02 270 top
H2  6,65.52 270 top
H3  6,41.02 270 top
H4  59.25,14.27 90 top
H5  54,14.27 90 top
H6  52,36.52 90 top
H7  55.75,36.52 270 top
H8  44.2,70.38 0 top
JP1  14.25,28.27 0 top
JP2  14.5,56.02 0 top
JP3  14.5,53.27 0 top
MIDI1  41.1,90.22 0 top
R1  11.25,45.52 270 top
R2  11.25,41.77 90 top
R3  11,37.27 90 top
R4  11,34.02 90 top
R5  21.25,28.02 90 top
R6  21.38,23.99 90 top
R7  10.5,75.02 180 top
R8  10.5,72.02 180 top
R9  10.5,69.02 180 top
R10  10.5,66.02 180 top
R11  10.5,63.02 180 top
R12  10.5,60.02 180 top
R13  10.5,73.52 0 top
R14  10.5,70.52 0 top
R15  10.5,67.52 0 top
R16  10.5,64.52 0 top
R17  10.5,61.52 0 top
R18  10.5,58.52 0 top
R19  17.75,58.27 0 top
R20  26.25,62.77 180 top
R21  17.75,62.77 0 top
R22  17.97,70.81 0 top
R23  26.96,70.34 90 top
R24  28.25,27.52 0 top
R25  33.25,27.52 0 top
R26  33.25,51.27 0 top
R27  28.25,25.77 180 top
R28  33.25,25.77 180 top
R29  33.25,49.52 180 top
R30  33.25,82.77 0 top
R31  43,82.77 0 top
R32  38.45,76.07 180 top
R33  43,76.02 0 top
R34  47.5,76.02 180 top
R35  33.25,42.52 180 top
R36  27.75,42.52 180 top
R37  27.5,49.52 180 top
R38  33.25,44.27 180 top
R39  27.75,44.27 180 top
R40  27.5,51.27 180 top
R41  33.5,67.52 270 top
T1  38.5,82.02 0 top
T2  48,82.02 0 top
TP2  26.94,66.94 0 top
TP3  17.36,68.94 0 top
TP_1  16.35,49.69 0 top
TP_2  23,45.27 0 top
TP_3  19.95,49.69 0 top
TP_4  18.21,37.61 0 top
TP_5  18.09,33.36 0 top
TP_6  30.97,32.36 0 top
TP_7  31.75,37.27 0 top
TP_SER  39.45,54.11 0 top
U1  19.25,46.27 90 top
U2  25.65,35.37 270 top
U3  22.36,67.83 270 top
U4  24,10.02 180 top
U5  32.29,10.43 270 top
U6B  42,58.52 90 top
U$1  14,97.52 0 top
X1  57.5,71.02 0 top

### Tracks (layer width: path | path; a pad name or v marks a point on that pad's centre or on a via)
!RST  (via drill 0.4)
  Top 0.203: R41.2 C35.1 36.6,66.77 37.5,66.77 38.5,67.77 42.5,67.77 42.93,68.2 H8.2 | U6B.23 40.75,61.77 40,62.27 40,64.27 v41.75,65.77
  Bottom 0.203: v41.75,65.77 41.75,67.02 42.88,68.14 42.88,70.32 H8.2
+3.3V  (via drill 0.4)
  Top 0.203: U6B.30 38.5,57.77 38.5,58.27 U6B.29
  Top 0.406: C32.1 52.24,9.97 H5.2 H5.4 H5.6 H5.8 52.73,20.5 54,21.77 58,21.77 60.5,24.27 60.5,48.27 58.5,50.27 58.5,61.52 55.75,64.27 v46,64.27 | v34.75,61.02 33.75,61.02 33.5,61.27 C34.1 33.35,61.77 32.5,61.77 32,62.27 32,67.52 32.65,68.17 R41.1 | C33.1 36.25,61.27 36,61.02 v34.75,61.02 | 38.5,58.27 37.5,58.27 36.75,59.02 35,59.02 34.75,59.27 v34.75,61.02
  Top 0.61: U5.5 35.64,11.38 36,11.02 C31.1 C32.1
  Bottom 0.406: v34.75,61.02 35.5,61.77 35.5,63.27 37,64.77 43,64.77 43.75,64.02 45,64.02 45.47,64.49 | H8.3 45.47,64.49 | v46,64.27 45.69,64.27 45.47,64.49
+5V
  Top 0.406: 29.5,9.37 30.25,8.62 30.25,7.27 32,5.52 41.75,5.52 43.75,7.52 56.5,7.52 57.98,9 H4.2 H4.4 H4.6 H4.8 57.98,20 61.5,23.52 61.5,63.77 62.25,64.52 62.25,75.52 61,76.77 52,76.77 51,75.77 51,74.27 50.5,73.77 43.75,73.77 43.12,74.39 | R30.1 C23.1 32.4,76.12 C22.1 32.25,75.97 32.25,74.52 32.5,74.27 43,74.27 43.12,74.39 | R33.2 43.65,74.92 43.12,74.39
  Top 0.61: 27,11.52 27,10.37 C29.1 28.5,9.37 | 27,11.52 27,12.52 27.65,13.17 C30.1 | U4.1 25.98,11.52 27,11.52 | U5.3 30.88,9.37 29.5,9.37 28.5,9.37 | U5.1 29.36,11.38 29,11.02 29,9.87 28.5,9.37
+VE  (via drill 0.4)
  Top 0.203: 20.65,85.62 v20.75,85.52
  Top 0.406: v22.25,74.52 21.95,74.52 D1.2 | v22.25,74.52 23.5,74.52 24,75.02 24,75.52 D2.2 | 20.7,85.47 v20.75,85.52 | U3.8 24.41,69.36 24.25,69.52 21.75,69.52 21.5,69.77 21.5,70.73 C15.1 21.57,70.96 C17.1 21.57,73.95 v22.25,74.52 | U$1.12 20.65,85.62
  Bottom 0.406: v20.75,85.52 21,85.27 21,80.02 19.75,78.77 19.25,78.77 17.25,76.77 17.25,74.77 17.5,74.52 v22.25,74.52
-VE  (via drill 0.4)
  Top 0.406: D2.1 22.85,77.17 21.5,78.52 19.5,78.52 18.25,77.27 | 18.25,77.27 18.25,75.77 18.5,75.52 19.45,75.52 D1.1 | v17.25,78.27 17.25,77.52 17.5,77.27 18.25,77.27 | C18.2 21.6,64.61 C16.2 21.48,66.29 21,66.77 20.39,66.77 U3.4 19.59,66.85 v19,66.27
  Bottom 0.406: v19,66.27 18,66.27 16.5,67.77 16.5,77.52 v17.25,78.27 17.25,79.02 17.75,79.52 18.75,79.52 19.75,80.52 19.75,86.52 19.15,87.12 U$1.13
AVCC
  Top 0.61: H1.1 H1.2 7.4,23.37 9,21.77 9.8,21.77 FB1.1
CH1_GK
  Top 0.203: H2.1 7.89,74.41 8.5,75.02 R7.2
CH2_GK
  Top 0.203: H2.2 9.7,71.87 R8.2
CH3_GK
  Top 0.203: H2.3 7.69,69.33 8,69.02 R9.2
CH4_GK
  Top 0.203: H2.4 7.23,66.79 8,66.02 R10.2
CH5_GK
  Top 0.203: H2.5 6.77,64.25 8,63.02 R11.2
CH6_GK
  Top 0.203: H2.6 7.81,61.71 8,61.52 8,60.52 8.5,60.02 R12.2
CH7_GK_SW
  Bottom 0.203: JP2.1 10.75,56.02 9,57.77 3.25,57.77 2.5,58.77 2.5,85.14 4.25,86.89 12.25,86.89 13.2,85.94 U$1.10
CH7_GK_SW/CV
  Top 0.203: H2.8 9.89,56.63 11.5,55.02 14,55.02 14.5,55.52 JP2.2
CH7_SW  (via drill 0.4)
  Top 0.203: U6B.10 45.75,57.27 v46,57.02 46,56.52 46.25,56.27 49.75,56.27 50.25,55.77 50.25,49.27 48.5,47.52 48.5,36.27 49.52,35.25 H6.4 | v21.5,56.02 JP2.3
  Bottom 0.203: v46,57.02 46,54.77 45.75,54.52 23,54.52 v21.5,56.02
CH8_GK_SW  (via drill 0.4)
  Top 0.203: U$1.11 15.7,87.94 15.12,88.52 3.12,88.52 v2,87.39
  Bottom 0.203: JP3.1 4.75,53.27 2,55.77 v2,87.39
CH8_GK_SW/CV
  Top 0.203: H3.1 13.89,49.91 14.5,50.52 JP3.2
CH8_SW  (via drill 0.4)
  Top 0.203: U6B.11 46.5,57.77 v47.25,57.02 49.75,57.02 50.75,56.02 50.75,49.02 49,47.27 49,38.52 49.73,37.79 H6.5 | v21.5,53.27 JP3.3
  Bottom 0.203: v47.25,57.02 47.25,55.02 46.25,54.02 23,54.02 v21.5,53.27
CH9_SW  (via drill 0.4)
  Top 0.203: H3.2 8.1,47.37 9.25,48.52 14,48.52 14.75,49.27 15.93,49.27 TP_1.TP 16.68,50.02 18.5,50.02 19.5,51.02 21.25,51.02 22.75,52.52 v22.75,56.02 | U6B.9 45,56.77 45.25,56.52 v45.25,56.02
  Bottom 0.203: v45.25,56.02 45.25,55.27 45,55.02 23.75,55.02 v22.75,56.02
CH10_CV
  Top 0.203: U1.1 21.98,45.29 22,45.27 22.25,45.77 | 22.25,45.77 22,46.02 21.38,46.02 U1.2 | TP_2.TP 23.16,45.11 | TP_2.TP 22.25,45.77 | R26.1 30,51.27 29.75,51.02 29.75,45.77 29.25,45.27 TP_2.TP
CH10_GK_VOL  (via drill 0.4)
  Top 0.203: v22,59.52 22,60.02 22.25,60.27 26.25,60.27 27,61.02 27,62.67 R20.1
  Bottom 0.203: JP1.1 3.75,28.27 1.5,30.52 1.5,51.02 2.25,51.77 17.75,51.77 18.5,52.52 18.5,57.02 19.5,58.02 21,58.02 22,59.02 v22,59.52
CH11_CV  (via drill 0.4)
  Top 0.203: U1.6 16.57,46.59 16.5,46.52 16.5,46.27 16.75,46.02 17.12,46.02 U1.7 17.27,46.02 18.25,46.02 v18.25,46.27 | TP_3.TP 20.83,49.69 21,49.52 v21,49.27 23.25,49.27 23.75,49.77 23.75,50.52 24.5,51.27 R40.2
  Bottom 0.203: v21,49.27 18.25,49.27 17.25,48.27 17.25,47.27 v18.25,46.27
CH12_CV
  Top 0.203: U2.2 20.85,36.67 20.75,36.77 20.75,37.02 | 20.75,37.02 21,37.27 21.98,37.27 U2.1 22.07,37.27 23,37.27 23.25,37.52 23.25,43.52 24,44.27 R39.2 | TP_4.TP 20.16,37.61 20.75,37.02
CH13_CV
  Top 0.203: 20.75,33.77 21.05,34.07 U2.6 22.07,34.02 23.5,34.02 24,34.52 24,38.27 24.5,38.77 29.25,38.77 29.75,39.27 29.75,43.77 30.25,44.27 R38.2 | 20.75,33.77 20.75,33.52 21.93,33.52 U2.7 | TP_5.TP 18.75,34.02 20.5,34.02 20.75,33.77
CH14_CV
  Top 0.203: U2.9 30.2,34.07 30.5,33.77 30.5,33.27 | 30.5,33.27 29.43,33.27 U2.8 29.75,32.94 29.75,30.27 29.5,30.02 28,30.02 27.6,29.62 R24.1 | TP_6.TP 30.97,32.8 30.5,33.27
CH15_CV
  Top 0.203: U2.13 30.15,36.67 30.5,37.02 30.5,37.27 | 30.5,37.27 29.32,37.27 U2.14 | 30.5,37.27 TP_7.TP 32,37.52 32.5,37.52 33,37.02 33,29.52 32.6,29.12 R25.1
CH15_CV_IN  (via drill 0.4)
  Top 0.203: v22.5,25.52 23.15,24.87 C8.1 23.52,24.64 R6.2 21.25,24.77 21.25,25.52 21,25.77 20.75,25.77 19.25,27.27 19.25,30.27 18.25,31.27 9.25,31.27 8.39,32.13 H3.8 | v30.5,25.52 31,26.02 31,28.52 32.5,30.02 32.5,35.52 32,36.02 U2.12
  Bottom 0.203: v22.5,25.52 23,25.02 30,25.02 v30.5,25.52
D_VIN
  Top 0.61: FB2.2 12.2,13.32 13,12.52 14.8,12.52 C2.+ 18.7,12.72 19,13.02 19.85,13.02 C27.1 20.15,13.02 21,13.02 21.5,12.52 21.5,11.52 | 21.5,11.52 21.5,10.02 20.85,9.37 C28.1 | U4.3 22.02,11.52 21.5,11.52
DVCC
  Top 0.61: H1.5 H1.6 7.31,13.21 8.75,11.77 9.95,11.77 FB2.1
GK_VOL
  Top 0.203: R23.2 26.96,71.56 26,72.52 26,81.02 23.4,83.62 U$1.8
GND  (via drill 0.4, 1.5)  (1 unrouted)
  Top 0.203: U6B.27 38,59.27 v37.25,60.02
  other vias: 24.25,70.77 24.25,71.77 14.25,60.02 14.25,62.52 14.25,61.27 14.5,69.02 14.5,67.52 30.75,49.52 30.75,47.02 25.25,49.52 25.25,47.52 25.25,40.52 25.25,42.52 36.75,70.52 33.75,70.52 35.25,70.52 36.25,65.52 34.25,65.52 17.75,24.52 19.25,24.52 20.75,19.02 22.25,19.02 23.75,19.02 25.25,19.02 53.75,57.02 53.75,54.02 53.75,55.52 53.75,52.52 53.75,51.02 56.25,24.27 55.25,24.27 54.25,24.27 53.25,24.27 11.5,95.02 16.5,95.02
  pour Top: 27.5,100.02 27.5,84.52 29.5,82.52 29.5,61.02 31,59.52 31,58.02 22,58.02 21.5,57.52 20.5,57.52 19.5,56.52 19.5,53.02 18,51.52 4,51.52 2.75,50.02 2.75,34.52 4.25,32.77 7.25,32.77 9.25,30.77 12.75,30.77 13.25,30.02 13.25,25.27 15.25,25.27 15.25,30.77 14,31.52 9.5,31.52 7.25,33.77 4.75,33.77 3.75,34.77 3.75,49.52 5,50.77 18.5,50.77 20.5,52.77 20.5,56.27 21,56.77 33.75,56.77 35.5,55.02 35.5,53.02 36.5,52.02 36.5,50.02 39,47.52 41,47.52 42,46.52 42,18.02 41.5,17.52 0,17.52 0,100.02
  pour Top: 28.5,100.02 28.5,85.52 30.5,83.52 30.5,61.52 33.5,58.52 36.5,55.52 36.5,53.52 37,53.02 37.5,52.52 37.5,50.52 39.5,48.52 41.5,48.52 43,47.02 43,17.52 42,16.52 0,16.52 0,0.02 65,0.02 65,100.02
  pour Bottom: 27.5,100.02 27.5,84.52 29.5,82.52 29.5,61.02 31,59.52 31,58.02 22,58.02 21.5,57.52 20.5,57.52 19.5,56.52 19.5,53.02 18,51.52 4,51.52 2.75,50.02 2.75,34.52 4.25,32.77 7.25,32.77 9.25,30.77 12.75,30.77 13.25,30.02 13.25,25.27 15.25,25.27 15.25,30.77 14,31.52 9.5,31.52 7.25,33.77 4.75,33.77 3.75,34.77 3.75,49.52 5,50.77 18.5,50.77 20.5,52.77 20.5,56.27 21,56.77 33.75,56.77 35.5,55.02 35.5,53.02 36.5,52.02 36.5,50.02 39,47.52 41,47.52 42,46.52 42,18.02 41.5,17.52 0,17.52 0,100.02
  pour Bottom: 28.5,100.02 28.5,85.52 30.5,83.52 30.5,61.52 36.5,55.52 36.5,53.52 37.5,52.52 37.5,50.52 39.5,48.52 41.5,48.52 43,47.02 43,17.52 42,16.52 0,16.52 0,0.02 65,0.02 65,100.02
MONO_GK
  Top 0.203: H2.7 6.6,59.17 8.25,57.52 15.75,57.52 16.5,58.27 R19.1 17,58.17
N$1
  Top 0.406: R31.2 43.85,86.87 44.5,87.52 45.9,87.52 MIDI1.5
N$2
  Top 0.406: R31.1 41,82.77 40.25,83.52 38.9,83.52 T1.3
N$3
  Top 0.406: T1.1 37.55,76.32 R32.2
N$4
  Bottom 0.203: H3.3 8.44,44.83 9.5,43.77 9.5,37.52 14.25,32.77 JP1.2
N$5
  Top 0.406: MIDI1.4 34.95,87.72 34.25,87.02 34.25,82.92 R30.2
N$8
  Top 0.406: T2.1 47.05,77.82 46.5,77.27 46.5,76.37 R34.2
N$9
  Top 0.406: R32.1 39.15,76.02 R33.1 42.35,77.62 43.25,78.52 44.5,78.52 45.5,79.52 45.5,83.02 45.75,83.27 47.85,83.27 T2.3
N$10  (via drill 0.4)
  Top 0.203: 11.21,44.83 R1.2 | R1.2 12.15,44.87 12.5,44.52 13.35,44.52 C3.1 13.65,44.52 15,44.52 15.25,44.77 15.25,47.52 15.75,48.02 22.25,48.02 22.5,47.77 22.5,46.77 22.32,46.59 U1.3 | v11.25,44.27 R1.2
  Bottom 0.203: JP1.3 16.25,33.27 10.75,38.77 10.75,43.77 v11.25,44.27
N$11
  Top 0.203: H3.4 8.27,42.29 8.5,42.52 11.15,42.52 R2.2 12.15,42.42 12.5,42.77 13.35,42.77 C4.1 13.65,42.77 15.75,42.77 16,43.02 16,47.02 16.25,47.27 16.27,47.24 U1.5
N$14
  Top 0.203: H3.5 7.52,39.75 9.25,38.02 10.9,38.02 R3.2 13.23,37.92 C5.1 15.12,38.15 15.75,37.52 15.75,36.27 16,36.02 U2.3
N$19
  Top 0.203: H3.6 7.56,37.21 10,34.77 10.9,34.77 R4.2 13.3,34.67 C6.1 13.65,35.02 15.25,35.02 15.75,34.52 20.5,34.52 20.7,34.72 U2.5
N$20  (via drill 0.4)
  Top 0.203: H3.7 7.1,34.67 10,32.02 19.5,32.02 21,30.52 21,28.92 R5.2 | 21.15,28.77 R5.2 | R5.2 22.5,28.67 | 22.5,28.67 23.55,28.67 C7.1 | U2.10 31.3,34.72 32,34.02 32,30.52 30.5,29.02 30.5,27.02 v30,26.52 | v22.5,27.02 22.5,28.67
  Bottom 0.203: v30,26.52 23,26.52 v22.5,27.02
N$21  (via drill 0.4)
  Top 0.203: R22.1 17.32,73.09 v17.5,73.27 | v25.25,78.77 22.5,81.77 21.75,82.52 19.25,82.52 18.88,82.89 17.88,82.89 17.38,82.39 16.5,82.39 16.12,82.77 16,82.77 15.5,83.27 14.75,83.27 U$1.7
  Bottom 0.203: v17.5,73.27 24.75,73.27 25.25,73.77 v25.25,78.77
N$35
  Top 0.203: D2.3 24.9,77.37 25.25,77.02 25.25,68.02 | 25.25,68.02 25.25,67.77 25,67.52 24.43,67.52 U3.6 | U3.7 25.11,68.15 25.25,68.02 | R23.1 26.17,69.69 26,69.52 26,68.27 25.75,68.02 25.25,68.02
N$36
  Top 0.203: R20.2 C14.1 25.25,64.77 24.5,65.52 24.5,66.76 U3.5 26.86,66.85 TP2.TP
N$37
  Top 0.203: R19.2 18.4,60.07 C13.2
N$38
  Top 0.203: C13.1 16.9,62.57 R21.1 17.1,67.12 17.5,67.52 | 17.5,67.52 20.3,67.52 U3.3 | TP3.TP 17.36,67.66 17.5,67.52
N$39
  Top 0.203: U3.2 19.61,68.15 19.5,68.27 19.5,68.52 | 19.5,68.52 19.5,68.77 19.75,69.02 20.09,69.02 U3.1 20.31,68.96 20.25,69.02 D1.3 | R22.2 18.62,68.9 19,68.52 19.5,68.52
N$42
  Top 0.203: R13.2 R7.1 11.15,75.87 11,76.02 8.5,76.02 8.25,76.27 8.2,76.27 U$1.1
N$43
  Top 0.203: R14.2 R8.1 12.5,72.02 12.75,72.27 12.75,81.02 12.15,81.62 U$1.2
N$44
  Top 0.203: R15.2 R9.1 13.5,69.02 13.75,69.27 13.75,81.02 14.35,81.62 U$1.3
N$45
  Top 0.203: R16.2 R10.1 14.5,66.02 15.5,66.77 15.5,79.02 16.25,79.77 17.75,79.77 18.2,80.22 U$1.4
N$46  (via drill 0.4)
  Top 0.203: R17.2 R11.1 v12,63.02
  Bottom 0.203: v12,63.02 4,63.02 3.5,63.52 3.5,82.27 4.85,83.62 U$1.5
N$47  (via drill 0.4)
  Top 0.203: R18.2 R12.1 v12,60.02
  Bottom 0.203: v12,60.02 8.5,60.02 8,60.52 3.75,60.52 3,61.27 3,83.52 4.12,84.64 7.12,84.64 7.38,84.89 9.88,84.89 11.15,83.62 U$1.6
P1.0
  Top 0.203: C21.1 33.9,47.47 R29.1 R26.2 33.9,52.67 34.25,53.02 36.75,53.02 37.25,53.52 37.25,55.27 38.25,56.27 38.25,57.02 38.5,57.27 U6B.31
P1.1  (via drill 0.4)
  Top 0.203: U6B.1 39.75,55.52 38.5,55.52 38,55.02 v38,52.77 | v46.75,49.27 47,49.02 47,29.27 48.5,27.77 51.86,27.77 H6.1
  Bottom 0.203: v46.75,49.27 46.25,49.77 39.75,49.77 39,50.52 39,52.02 38.5,52.52 38.25,52.52 v38,52.77
P1.2  (via drill 0.4)
  Top 0.203: U6B.2 40.75,53.27 40.25,52.77 v39.75,52.77 39.45,53.07 TP_SER.TP | v49.75,76.02 R34.1
  Bottom 0.203: v39.75,52.77 39.75,51.27 40.25,50.77 48.25,50.77 49.75,51.77 49.75,61.02 49.25,61.52 49.25,67.77 50,68.52 50,75.77 v49.75,76.02
P1.3  (via drill 0.4)
  Top 0.203: C26.1 28.15,47.47 R37.1 R40.1 28.25,51.37 28.25,51.77 28.5,52.02 v30,52.02 | U6B.3 41.25,52.27 41,52.02 v36,52.02
  Bottom 0.203: v36,52.02 v30,52.02
P1.4
  Top 0.203: C25.1 28.4,40.47 R36.1 R39.1 29.25,44.27 30.5,45.52 35.25,45.52 35.75,46.02 35.75,50.77 36.25,51.27 41.5,51.27 41.75,51.52 U6B.4
P1.5
  Top 0.203: U6B.5 42.25,51.27 41.75,50.77 36.75,50.77 36.25,50.27 36.25,44.77 35.75,44.27 R38.1 R35.1 33.9,40.22 C24.1
P1.6  (via drill 0.4)
  Top 0.203: C19.1 28.9,23.72 R27.1 R24.2 29.15,27.77 v29.5,28.27 | U6B.21 v41.75,63.02
  Bottom 0.203: v41.75,63.02 U6B.21 42,60.77 45.5,60.77 45.75,60.52 45.75,58.52 46,58.27 47.25,58.27 48.25,57.27 48.25,55.02 46.75,53.52 24,53.52 23.5,53.02 23.5,29.02 25,27.52 28.75,27.52 v29.5,28.27
P1.7  (via drill 0.4)
  Top 0.203: C20.1 33.9,23.72 R28.1 R25.2 36.25,27.52 37,28.27 37,50.02 37.25,50.27 42.25,50.27 43,51.02 v43,52.02 | U6B.22 41.25,62.02 40.5,62.52 40.5,63.27 v40.75,63.77
  Bottom 0.203: v40.75,63.77 42,63.77 42.5,63.27 42.5,61.77 42.75,61.52 45.75,61.52 46.25,61.02 46.25,59.02 46.5,58.77 48,58.77 49,57.77 49,54.77 47,52.77 43.25,52.77 43,52.52 v43,52.02
P2.3
  Top 0.203: U6B.15 53.5,59.77 54.88,58.39 55.25,58.02 55.25,46.77 55.75,46.27 H7.1
P2.4
  Top 0.203: U6B.16 54.25,60.27 55.75,58.77 55.75,48.27 57.75,46.52 57.75,43.52 57.25,43.02 55.4,43.02 H7.2
P2.5
  Top 0.203: H7.3 56.81,40.33 58.25,41.52 58.25,46.77 56.25,48.52 56.25,59.02 54.25,61.02 U6B.17
P2.6
  Top 0.203: U6B.26 38.5,59.77 38.25,60.02 38.25,66.02 39.25,67.02 55,67.02 55.75,67.77 55.75,72.27 56.25,72.77 59.01,72.77 X1.1 58.3,73.52 C37.2
P2.7
  Top 0.203: U6B.25 39.51,60.76 38.75,61.52 38.75,65.77 39.5,66.52 53.25,66.52 | 53.25,66.52 57.82,66.52 X1.2 | C36.2 53.04,66.3 53.25,66.52
P3.0
  Top 0.203: H6.3 49.56,32.71 48,34.27 48,53.02 47,54.02 44,54.02 43.25,54.77 U6B.7
P3.1
  Top 0.203: U6B.6 42.75,54.27 43.5,53.52 46.75,53.52 47.5,52.77 47.5,32.52 49.75,30.27 51.9,30.27 H6.2
P3.2
  Top 0.203: H6.6 50.44,40.33 49.5,41.27 49.5,47.02 51.25,48.77 51.25,58.02 51,58.27 U6B.12
P3.3
  Top 0.203: U6B.13 51.25,58.77 51.75,58.27 51.75,48.52 50,46.77 50,43.02 50.25,42.77 51.9,42.77 H6.7
P3.4
  Top 0.203: U6B.14 51.5,59.27 52.25,58.52 52.25,45.66 H6.8
P3.5
  Top 0.203: H7.4 56.27,37.79 58.75,40.02 58.75,47.02 56.75,48.77 56.75,59.27 54.5,61.52 45.25,61.52 44.5,62.27 43.5,62.27 43.25,61.77 U6B.18
P3.6
  Top 0.203: H7.5 56.23,35.25 59.25,38.02 59.25,47.27 57.25,49.02 57.25,59.77 55,62.02 45.5,62.02 44.75,62.77 43.25,62.77 42.75,62.02 U6B.19
P3.7
  Top 0.203: U6B.20 42.25,62.27 43,63.27 45,63.27 45.75,62.52 55.5,62.52 57.75,60.27 57.75,49.27 59.75,47.52 59.75,34.52 57.75,32.77 55.31,32.77 H7.6
TEST  (via drill 0.4)
  Top 0.203: v40.25,65.77 40.25,65.52 39.5,64.77 39.5,61.76 U6B.24
  Bottom 0.203: v40.25,65.77 40.25,70.24 H8.1
VIN  (via drill 0.4)
  Top 0.203: C9.1 21.25,31.52 | v19.75,35.27 19.8,35.27
  Top 0.254: 21.25,31.52 19.75,33.02 v19.75,33.27 | 19.8,35.27 19.9,35.37 U2.4
  Top 0.406: U1.8 17.25,45.24 17.25,43.52 17.5,43.27 C12.1 18.3,43.17 C11.1 18.3,40.47 v19.75,39.02 | FB1.2 14.9,23.57 C1.+ 15,24.02 | C9.1 22.3,30.72 23,30.02 25.25,30.02 | 25.25,30.02 26.25,30.02 26.5,30.27 26.5,31.37 C10.1 | 15,24.77 15,24.02 | 15,24.02 15.75,23.27 17.25,23.27 19,21.52 25.25,21.52 25.75,22.02 25.75,29.52 25.25,30.02
  Bottom 0.406: v19.75,33.27 v19.75,35.27 v19.75,39.02

### Text on the board
tNames: 13P_OUT | MIDI_OUT | CH1_GK | DVCC | CH2_GK | TEST | /RST | DGND | CH3_GK | CH4_GK | CH5_GK | CH6_GK | MONO_GK | CH7_SW | GK | MIDI | GK | MIDI | CH8_SW | CH9_SW | MCU AUXILLARY / PINS | P3.4 | P2.3 | CH10_CV/ / GK_VOL | CH11_CV | P3.3 | P2.4 | CH12_CV | P3.2 | P2.5 | P2.2 | P3.5 | CH13_CV | P2.1 | P3.6 | CH14_CV | CH15_CV | P3.0 | P3.7 | GK | MIDI | P3.1 | GND | P1.1 | GND | AVCC | GK + MIDI BOARD v2.5 | AVCC | AGND | 3.3V | GND | 5V | GND | AGND | DVCC | DVCC | DGND | DGND | DIGITAL SUPPLY / EXPANSION